# Altium schematic sheet STM32F429IGT61_STM32F429IGT6.schdoc
size 127 x 294 mm
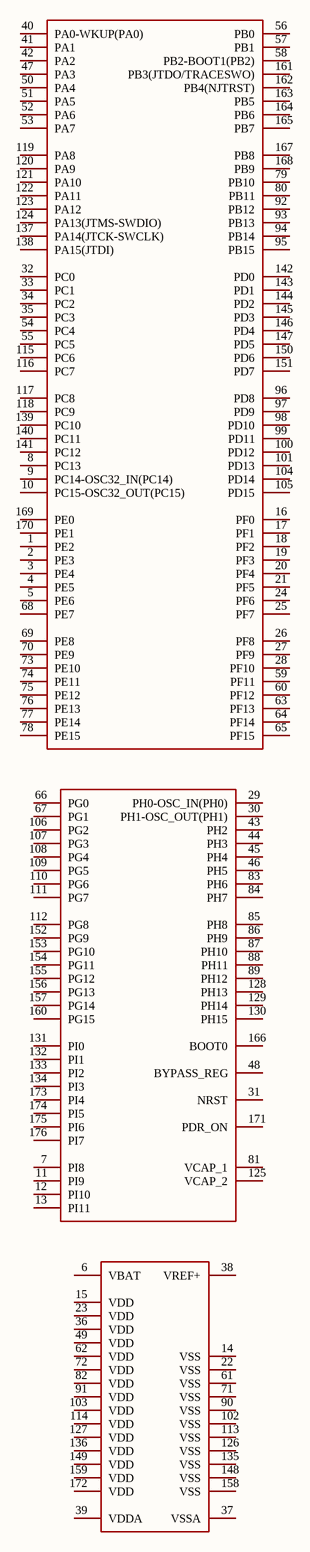
[diagram p0: STM32F429IGT61_STM32F429IGT6.schdoc]

## Parts
(Parts that share a designator on the sheet are numbered #1, #2 ... from top to bottom, then left to right.)
U?#1  STM32F429IGT6  [LQFP-176_L24.0-W24.0-P0.50-LS26.0-BL]  (value not drawn)  (part A of 3)
U?#2  STM32F429IGT6  [LQFP-176_L24.0-W24.0-P0.50-LS26.0-BL]  (value not drawn)  (part B of 3)
U?#3  STM32F429IGT6  [LQFP-176_L24.0-W24.0-P0.50-LS26.0-BL]  (value not drawn)  (part C of 3)

## Nets

Not connected (* = marked no-connect by the designer): U?#1 1(PE2) 2(PE3) 3(PE4) 4(PE5) 5(PE6) 8(PC13) 9(PC14-OSC32_IN(PC14)) 10(PC15-OSC32_OUT(PC15)) 16(PF0) 17(PF1) 18(PF2) 19(PF3) 20(PF4) 21(PF5) 24(PF6) 25(PF7) 26(PF8) 27(PF9) 28(PF10) 32(PC0) 33(PC1) 34(PC2) 35(PC3) 40(PA0-WKUP(PA0)) 41(PA1) 42(PA2) 47(PA3) 50(PA4) 51(PA5) 52(PA6) 53(PA7) 54(PC4) 55(PC5) 56(PB0) 57(PB1) 58(PB2-BOOT1(PB2)) 59(PF11) 60(PF12) 63(PF13) 64(PF14) 65(PF15) 68(PE7) 69(PE8) 70(PE9) 73(PE10) 74(PE11) 75(PE12) 76(PE13) 77(PE14) 78(PE15) 79(PB10) 80(PB11) 92(PB12) 93(PB13) 94(PB14) 95(PB15) 96(PD8) 97(PD9) 98(PD10) 99(PD11) 100(PD12) 101(PD13) 104(PD14) 105(PD15) 115(PC6) 116(PC7) 117(PC8) 118(PC9) 119(PA8) 120(PA9) 121(PA10) 122(PA11) 123(PA12) 124(PA13(JTMS-SWDIO)) 137(PA14(JTCK-SWCLK)) 138(PA15(JTDI)) 139(PC10) 140(PC11) 141(PC12) 142(PD0) 143(PD1) 144(PD2) 145(PD3) 146(PD4) 147(PD5) 150(PD6) 151(PD7) 161(PB3(JTDO/TRACESWO)) 162(PB4(NJTRST)) 163(PB5) 164(PB6) 165(PB7) 167(PB8) 168(PB9) 169(PE0) 170(PE1); U?#2 7(PI8) 11(PI9) 12(PI10) 13(PI11) 29(PH0-OSC_IN(PH0)) 30(PH1-OSC_OUT(PH1)) 31(NRST) 43(PH2) 44(PH3) 45(PH4) 46(PH5) 48(BYPASS_REG) 66(PG0) 67(PG1) 81(VCAP_1) 83(PH6) 84(PH7) 85(PH8) 86(PH9) 87(PH10) 88(PH11) 89(PH12) 106(PG2) 107(PG3) 108(PG4) 109(PG5) 110(PG6) 111(PG7) 112(PG8) 125(VCAP_2) 128(PH13) 129(PH14) 130(PH15) 131(PI0) 132(PI1) 133(PI2) 134(PI3) 152(PG9) 153(PG10) 154(PG11) 155(PG12) 156(PG13) 157(PG14) 160(PG15) 166(BOOT0) 171(PDR_ON) 173(PI4) 174(PI5) 175(PI6) 176(PI7); U?#3 6(VBAT) 14(VSS) 15(VDD) 22(VSS) 23(VDD) 36(VDD) 37(VSSA) 38(VREF+) 39(VDDA) 49(VDD) 61(VSS) 62(VDD) 71(VSS) 72(VDD) 82(VDD) 90(VSS) 91(VDD) 102(VSS) 103(VDD) 113(VSS) 114(VDD) 126(VSS) 127(VDD) 135(VSS) 136(VDD) 148(VSS) 149(VDD) 158(VSS) 159(VDD) 172(VDD)

## Library data of the parts
U?#1-U?#3 = STM32F429IGT6: Manufacturer: ST(意法半导体); Add into BOM: yes; CPU Core: ARM-M4; CPU Maximum Speed: 180MHz; Program Storage Size: 1MB; Program Memory Type: FLASH; Number of I/O: 140; ADC (Bit): 12bit; Voltage - Supply: 1.8V~3.6V; Symbol: STM32F429IGT6; Device: STM32F429IGT6; LCSC Part Name: 带DSP和FPU的高性能高级系列ARM Cortex-M4 MCU，具有1 MB Flash、180 MHz CPU、ART加速器、Chrom-ART加速器、TFT、带SDRAM的FMC和TFT; Supplier Part: C54328; Manufacturer Part: STM32F429IGT6; Supplier Footprint: LQFP-176(24x24); JLCPCB Part Class: Extended Part; Datasheet: https://item.szlcsc.com/datasheet/STM32F429IGT6/55346.html; Supplier: LCSC; Convert to PCB: yes; DAC (Bit): 12bit; Applications: -